# Altium schematic sheet LDO.SchDoc
size A4; SheetNumber: 4; SheetTotal: 4
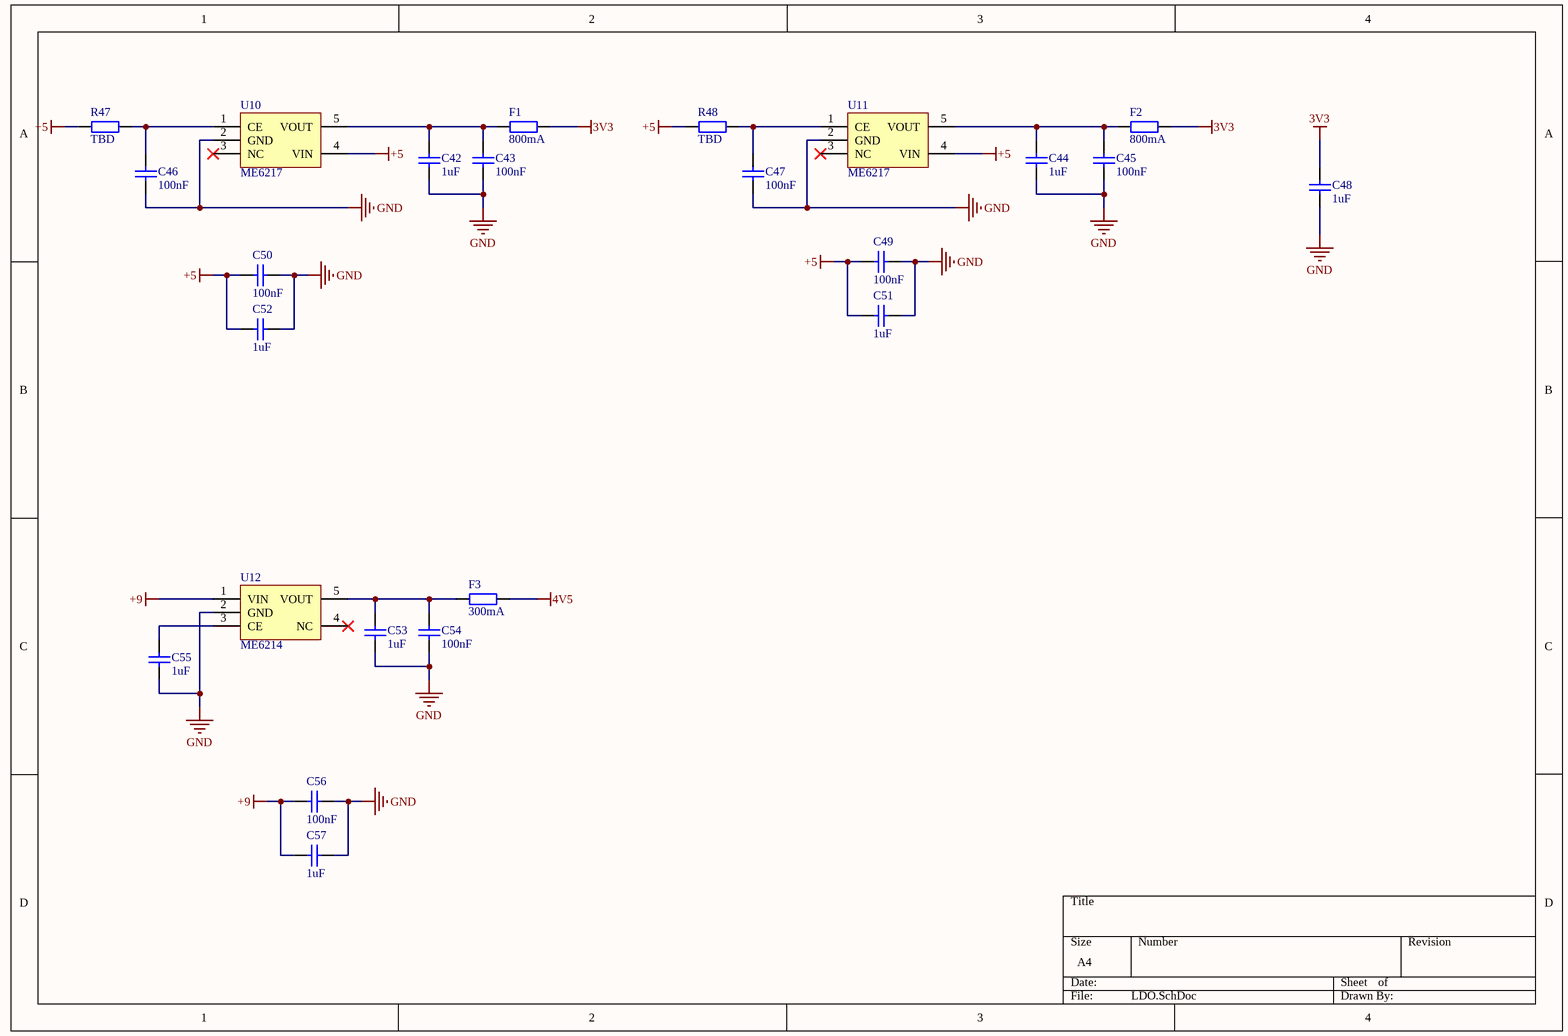
[diagram p0: LDO.SchDoc]

## Parts
C42  1uF  [C0402_NS]
C43  100nF  [C0402_NS]
C44  1uF  [C0402_NS]
C45  100nF  [C0402_NS]
C46  100nF  [C0402_NS]
C47  100nF  [C0402_NS]
C48  1uF  [C3216_NS]
C49  100nF  [C0402_NS]
C50  100nF  [C0402_NS]
C51  1uF  [C0402_NS]
C52  1uF  [C0402_NS]
C53  1uF  [C3216_NS]
C54  100nF  [C0402_NS]
C55  1uF  [C0402_NS]
C56  100nF  [C0402_NS]
C57  1uF  [C0402_NS]
F1  800mA  [R0603_NS]
F2  800mA  [R0603_NS]
F3  300mA  [R0603_NS]
R47  TBD  [R0402_NS]
R48  TBD  [R0402_NS]
U10  ME6217  [SOT23-5]
U11  ME6217  [SOT23-5]
U12  ME6214  [SOT23-5]

## Nets
3V3: C48.2 F1.2 F2.2
4V5: F3.2
+5: C49.2 C50.2 C51.2 C52.2 R47.1 R48.1 U10.4(VIN) U11.4(VIN)
+9: C56.2 C57.2 U12.1(VIN)
GND: C42.2 C43.1 C44.2 C45.1 C46.1 C47.1 C48.1 C49.1 C50.1 C51.1 C52.1 C53.1 C54.1 C55.2 C56.1 C57.1 U10.2(GND) U11.2(GND) U12.2(GND)
NetC42_1: C42.1 C43.2 F1.1 U10.5(VOUT)
NetC44_1: C44.1 C45.2 F2.1 U11.5(VOUT)
NetC46_2: C46.2 R47.2 U10.1(CE)
NetC47_2: C47.2 R48.2 U11.1(CE)
NetC53_2: C53.2 C54.2 F3.1 U12.5(VOUT)
NetC55_1: C55.1 U12.3(CE)

Not connected (* = marked no-connect by the designer): U10 3(NC)*; U11 3(NC)*; U12 4(NC)*

## Library data of the parts
C42-C47 C49-C52 C54-C57 = C0402: Capacitance 0402
C48 C53 = C
F1-F3 = R0603: Resistance 0603
R47 R48 = R0402: Resistance 0402